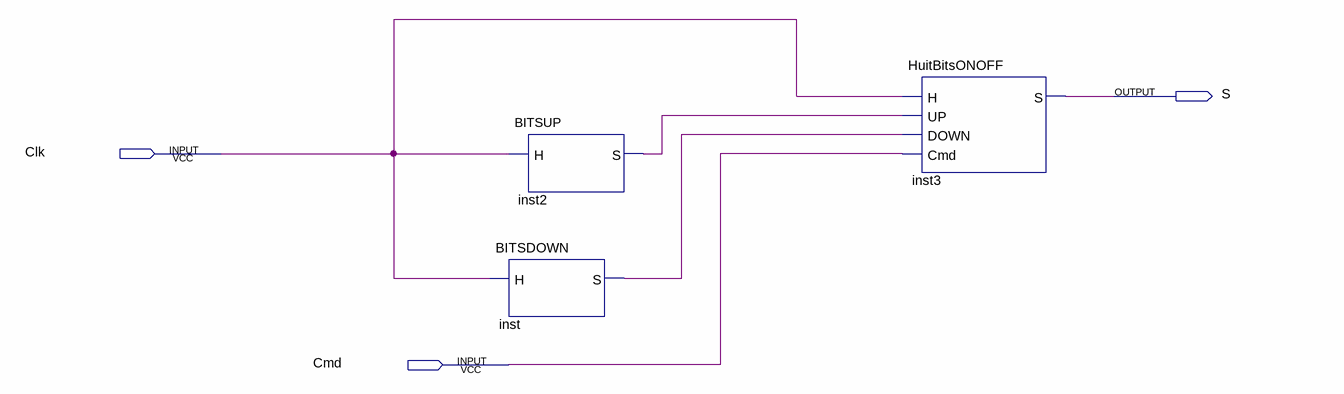
[diagram p0: schematic sheet]
// Quartus schematic Final.bdf as structural Verilog: 3 symbols, 3 pins
module Final (
  input  Clk,
  input  Cmd,
  output S
);

  wire inst2_s, inst_s;

  BITSUP inst2 (.H(Clk), .S(inst2_s));
  BITSDOWN inst (.H(Clk), .S(inst_s));
  HuitBitsONOFF inst3 (.H(Clk), .UP(inst2_s), .DOWN(inst_s), .Cmd(Cmd), .S(S));
endmodule
